# Altium schematic sheet propulsion_alim.SchDoc
size A3
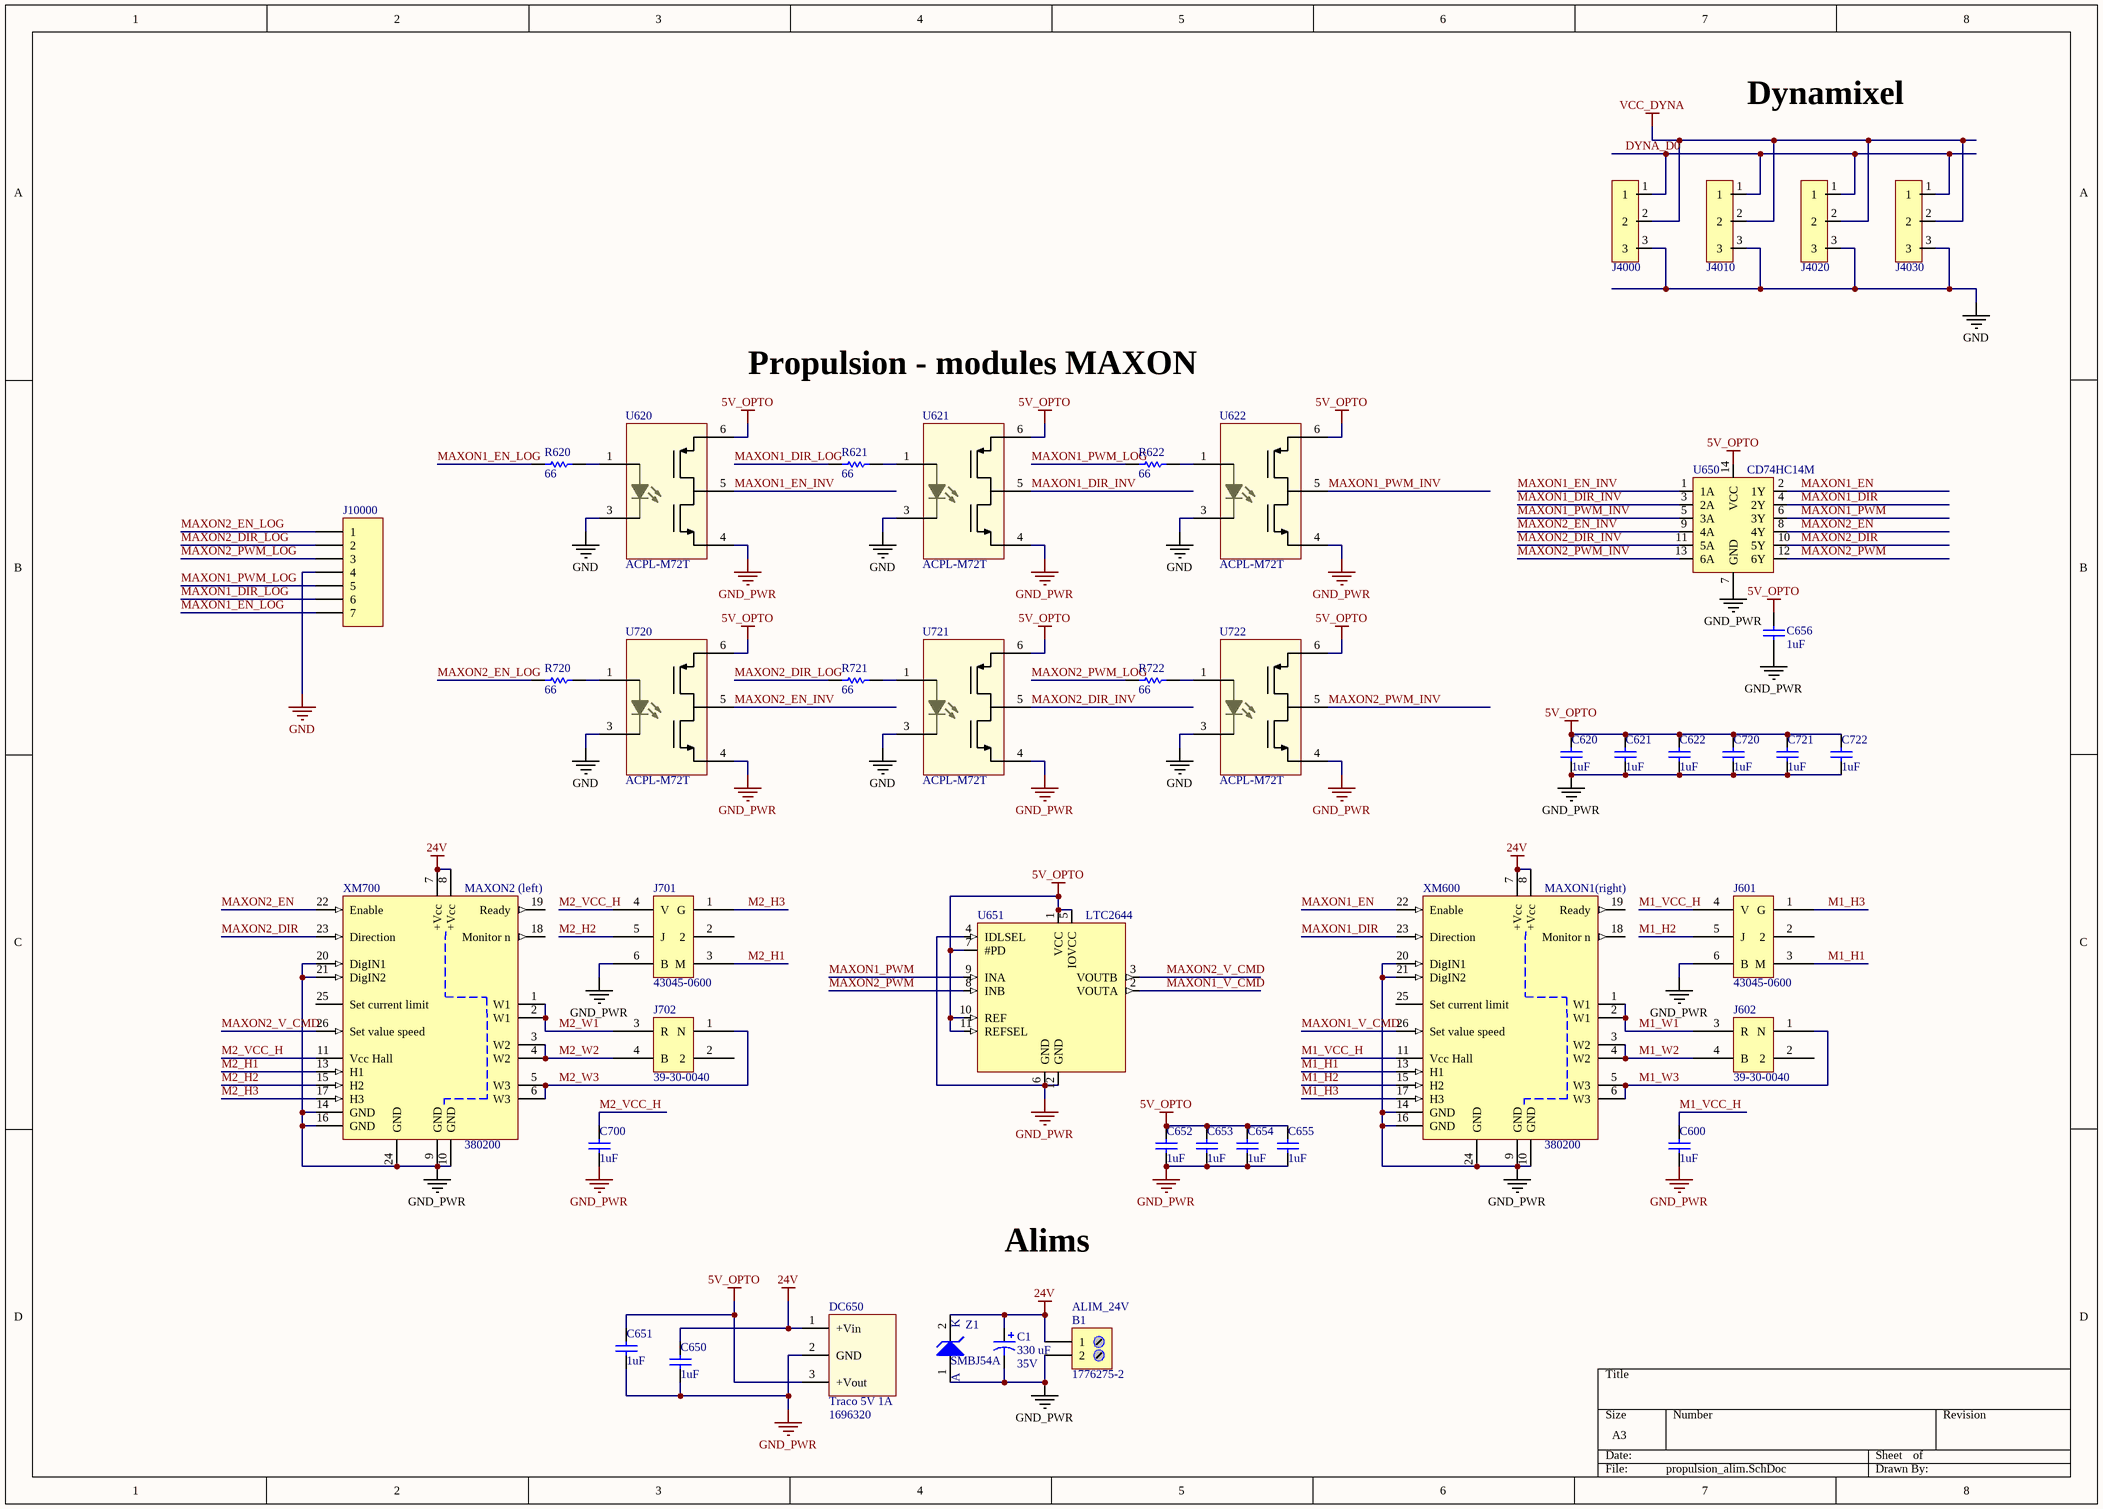
[diagram p0: propulsion_alim.SchDoc]

## Parts
B1  1776275-2  [BORNIER_2V_3.5MM]
C1  330 uF  RatedVoltage: 35V  [WCAP-ATG8_10x12.5x5x0.6]
C600  1uF  [WCAP-CSGP_0805, 2x1.25x1.25]
C620  1uF  [WCAP-CSGP_0805, 2x1.25x1.25]
C621  1uF  [WCAP-CSGP_0805, 2x1.25x1.25]
C622  1uF  [WCAP-CSGP_0805, 2x1.25x1.25]
C650  1uF  [WCAP-CSGP_0805, 2x1.25x1.25]
C651  1uF  [WCAP-CSGP_0805, 2x1.25x1.25]
C652  1uF  [WCAP-CSGP_0805, 2x1.25x1.25]
C653  1uF  [WCAP-CSGP_0805, 2x1.25x1.25]
C654  1uF  [WCAP-CSGP_0805, 2x1.25x1.25]
C655  1uF  [WCAP-CSGP_0805, 2x1.25x1.25]
C656  1uF  [WCAP-CSGP_0805, 2x1.25x1.25]
C700  1uF  [WCAP-CSGP_0805, 2x1.25x1.25]
C720  1uF  [WCAP-CSGP_0805, 2x1.25x1.25]
C721  1uF  [WCAP-CSGP_0805, 2x1.25x1.25]
C722  1uF  [WCAP-CSGP_0805, 2x1.25x1.25]
DC650  Traco 5V 1A  Supplier Part Number 1: 1696320  [TSR1]
J601  43045-0600  [43045-0600]
J602  39-30-0040  [39-30-0040]
J701  43045-0600  [43045-0600]
J702  39-30-0040  [39-30-0040]
J4000  22-03-5035  [20-03-5035]  (value not drawn)
J4010  22-03-5035  [20-03-5035]  (value not drawn)
J4020  22-03-5035  [20-03-5035]  (value not drawn)
J4030  22-03-5035  [20-03-5035]  (value not drawn)
J10000  (no value)  [HDR1X7]
R620  value 66  [RESC1608X06N]  (hidden comment: RC0603FR-0710KL)
R621  value 66  [RESC1608X06N]  (hidden comment: RC0603FR-0710KL)
R622  value 66  [RESC1608X06N]  (hidden comment: RC0603FR-0710KL)
R720  value 66  [RESC1608X06N]  (hidden comment: RC0603FR-0710KL)
R721  value 66  [RESC1608X06N]  (hidden comment: RC0603FR-0710KL)
R722  value 66  [RESC1608X06N]  (hidden comment: RC0603FR-0710KL)
U620  ACPL-M72T  [ACPL-M72T]
U621  ACPL-M72T  [ACPL-M72T]
U622  ACPL-M72T  [ACPL-M72T]
U650  CD74HC14M  [SOIC127P600X175-14N]
U651  LTC2644  [MSOP-12_LTC2644]
U720  ACPL-M72T  [ACPL-M72T]
U721  ACPL-M72T  [ACPL-M72T]
U722  ACPL-M72T  [ACPL-M72T]
XM600  380200  [380200_goldo]
XM700  380200  [380200_goldo]
Z1  SMBJ54A  [SMA Diode (DO-214AA)]

## Nets
5V_OPTO: C620.2 C621.2 C622.2 C651.2 C652.2 C653.2 C654.2 C655.2 C656.2 C720.2 C721.2 C722.2 DC650.3(+Vout) U620.6(VDD) U621.6(VDD) U622.6(VDD) U650.14(VCC) U651.1(VCC) U651.5(IOVCC) U651.7(#PD) U651.10(REF) U651.11(REFSEL) U720.6(VDD) U721.6(VDD) U722.6(VDD)
24V: B1.1 C1.1 C650.2 DC650.1(+Vin) XM600.7(+Vcc) XM600.8(+Vcc) XM700.7(+Vcc) XM700.8(+Vcc) Z1.2
GND: J4000.3 J4010.3 J4020.3 J4030.3 J10000.4 U620.3(Cathode) U621.3(Cathode) U622.3(Cathode) U720.3(Cathode) U721.3(Cathode) U722.3(Cathode)
GND_PWR: B1.2 C1.2 C600.1 C620.1 C621.1 C622.1 C650.1 C651.1 C652.1 C653.1 C654.1 C655.1 C656.1 C700.1 C720.1 C721.1 C722.1 DC650.2(GND) J601.6(B) J701.6(B) U620.4(GND) U621.4(GND) U622.4(GND) U650.7(GND) U651.4(IDLSEL) U651.6(GND) U651.12(GND) U720.4(GND) U721.4(GND) U722.4(GND) XM600.9(GND) XM600.10(GND) XM600.14(GND) XM600.16(GND) XM600.20(DigIN1) XM600.21(DigIN2) XM600.24(GND) XM700.9(GND) XM700.10(GND) XM700.14(GND) XM700.16(GND) XM700.20(DigIN1) XM700.21(DigIN2) XM700.24(GND) Z1.1
VCC_DYNA: J4000.2 J4010.2 J4020.2 J4030.2
DYNA_D0: J4000.1 J4010.1 J4020.1 J4030.1
M1_H1: J601.3(M) XM600.13(H1)
M1_H2: J601.5(J) XM600.15(H2)
M1_H3: J601.1(G) XM600.17(H3)
M1_VCC_H: C600.2 J601.4(V) XM600.11(Vcc_Hall)
M1_W1: J602.3(R) XM600.1(W1) XM600.2(W1)
M1_W2: J602.4(B) XM600.3(W2) XM600.4(W2)
M1_W3: J602.1(N) XM600.5(W3) XM600.6(W3)
M2_H1: J701.3(M) XM700.13(H1)
M2_H2: J701.5(J) XM700.15(H2)
M2_H3: J701.1(G) XM700.17(H3)
M2_VCC_H: C700.2 J701.4(V) XM700.11(Vcc_Hall)
M2_W1: J702.3(R) XM700.1(W1) XM700.2(W1)
M2_W2: J702.4(B) XM700.3(W2) XM700.4(W2)
M2_W3: J702.1(N) XM700.5(W3) XM700.6(W3)
MAXON1_DIR: U650.4(2Y) XM600.23(Direction)
MAXON1_DIR_INV: U621.5(Vo) U650.3(2A)
MAXON1_DIR_LOG: J10000.6 R621.1
MAXON1_EN: U650.2(1Y) XM600.22(Enable)
MAXON1_EN_INV: U620.5(Vo) U650.1(1A)
MAXON1_EN_LOG: J10000.7 R620.1
MAXON1_PWM: U650.6(3Y) U651.9(INA)
MAXON1_PWM_INV: U622.5(Vo) U650.5(3A)
MAXON1_PWM_LOG: J10000.5 R622.1
MAXON1_V_CMD: U651.2(VOUTA) XM600.26(Set_value_speed)
MAXON2_DIR: U650.10(5Y) XM700.23(Direction)
MAXON2_DIR_INV: U650.11(5A) U721.5(Vo)
MAXON2_DIR_LOG: J10000.2 R721.1
MAXON2_EN: U650.8(4Y) XM700.22(Enable)
MAXON2_EN_INV: U650.9(4A) U720.5(Vo)
MAXON2_EN_LOG: J10000.1 R720.1
MAXON2_PWM: U650.12(6Y) U651.8(INB)
MAXON2_PWM_INV: U650.13(6A) U722.5(Vo)
MAXON2_PWM_LOG: J10000.3 R722.1
MAXON2_V_CMD: U651.3(VOUTB) XM700.26(Set_value_speed)
NetR620_2: R620.2 U620.1(Anode)
NetR621_2: R621.2 U621.1(Anode)
NetR622_2: R622.2 U622.1(Anode)
NetR720_2: R720.2 U720.1(Anode)
NetR721_2: R721.2 U721.1(Anode)
NetR722_2: R722.2 U722.1(Anode)

Not connected (* = marked no-connect by the designer): J601 2; J602 2; J701 2; J702 2; XM600 12(nc) 18(Monitor_n) 19(Ready) 25(Set_current_limit); XM700 12(nc) 18(Monitor_n) 19(Ready) 25(Set_current_limit)

## Notes on the sheet
- Dynamixel
- Propulsion - modules MAXON
- (near XM700) MAXON2 (left)
- (near XM600) MAXON1(right)
- Alims
- (near B1) ALIM_24V
- (in symbol SMBJ54A) K; A

## Library data of the parts
B1 = 1776275-2: TERM BLOCK 2POS SIDE ENT 3.5MM; Manufacturer: TE Connectivity AMP Connectors; Supplier 1: Farnell; Supplier Part Number 1: 1098611; Manufacturer Part Number: 1776275-2; ComponentLink1URL: http://www.te.com/commerce/DocumentDelivery/DDEController?Action=srchrtrv&DocNm=1776275&DocType=Customer+Drawing&DocLang=English; ComponentLink1Description: http://www.te.com/commerce/DocumentDelivery/DDEController?Action=srchrtrv&DocNm=1776275&DocType=Customer+Drawing&DocLang=English
C1 = WCAP-ATG8, 860010575012: CAP Alu 330 UF 20% 35 V; Manufacturer: Wurth Elektronik; PublishedDate: July 2016; ComponentLink1Description: Manufacturer; ComponentLink1URL: http://www.we-online.de; ComponentLink2Description: Datasheet; ComponentLink2URL: http://katalog.we-online.de/pbs/datasheet/860010575012.pdf; Manufacturer Part Number: 860010575012; Value: 330 uF; Size: 10mmx12.5mm
C600 C620-C622 C650-C656 C700 C720-C722 = WCAP-CSGP, 885012207103: CAP CER 1uF 50V X7R 0805; Manufacturer: Wurth Elektronik; PublishedDate: Aug 2016; ComponentLink1Description: Manufacturer; ComponentLink1URL: http://www.we-online.de; ComponentLink2Description: Datasheet; ComponentLink2URL: http://katalog.we-online.com/pbs/datasheet/885012207103.pdf; Manufacturer Part Number: 885012207103; Value: 1uF; Size: 0805; CeramicType: X7R; RatedVoltage: 50V
DC650 = TSR1-24120: Traco 12.0V 12W 1A; Manufacturer: TRACOPOWER; Manufacturer Part Number: TSR1-2450; Pricing: 1=65.7, 5=63.73, 10=61.82, 25=59.97 (EUR); Supplier 1: Farnell
J601 J701 = 43045-0600: CONN HEADER 6POS 3MM RT ANG TIN; Manufacturer: MOLEX; Supplier 1: Farnell; Manufacturer Part Number: 43045-0600; ComponentLink1URL: http://www.farnell.com/datasheets/2216475.pdf; ComponentLink1Description: http://www.farnell.com/datasheets/2216475.pdf; Supplier Part Number 1: 1012252
J602 J702 = 39-30-0040: MOLEX  39-30-0040 4.2 mm, 4 Contact(s); Supplier 1: Farnell; Supplier Part Number 1: 1697133; Manufacturer: MOLEX; Manufacturer Part Number: 39-30-0040; ComponentLink1URL: http://www.farnell.com/datasheets/328793.pdf; ComponentLink1Description: http://www.farnell.com/datasheets/328793.pdf
J4000 J4010 J4020 J4030 = 20-03-5035: Manufacturer 1: MOLEX; Supplier 1: Farnell; Supplier Part Number 1: 9979620; Manufacturer Part Number: 22-03-5035; Pricing: 10=0.153, 100=0.144, 250=0.118, 500=0.091, 1000=0.059, 2500=0.057, 2500=0.0441, 30000=0.0397 (EUR); ComponentLink1URL: http://www.farnell.com/cad/495071.pdf; ComponentLink1Description: http://www.farnell.com/cad/495071.pdf; ComponentLink2URL: http://www.farnell.com/datasheets/1801024.pdf; ComponentLink2Description: http://www.farnell.com/datasheets/1801024.pdf; ComponentLink3Description: http://fr.farnell.com/jsp/level5/module.jsp?moduleId=fr/418942.xml; ComponentLink3URL: http://fr.farnell.com/jsp/level5/module.jsp?moduleId=fr/418942.xml; ComponentClass: 4_NUCLEO_DYNA
J10000 = HDR1X7: CONN HEADER 7POS 100MILS
R620-R622 R720-R722 = RC0603FR-0710KL: RES SMD 10K OHM 1% 1/10W 0603; Manufacturer: Yageo; Power: 100mW; Vmax: 50V; Manufacturer Part Number: RC0603FR-0710KL; Type: Thick Film; ComponentLink1Description: Manufacturer; ComponentLink1URL: http://www.yageo.com/NewPortal/_en/index.jsp; ComponentLink2Description: Datasheet; ComponentLink2URL: http://www.farnell.com/datasheets/2167052.pdf; Supplier 1: Farnell; Supplier Part Number 1: 9238603; Precision: ±1%
U620-U622 U720-U722 = ACPL-M72T: Optocoupleur; Manufacturer: AVAGO TECHNOLOGIES; Supplier 1: Mouser; Manufacturer Part Number: ACPL-M72T
U650 = CD74HC14M: IC HEX INV SCHMITT TRIG 14-SOIC; Manufacturer: Texas Instruments; Supplier 1: Farnell; Supplier Part Number 1: 1103160; Manufacturer Part Number: CD74HC14M; ComponentLink1URL: http://www.ti.com/lit/ds/symlink/cd74hc14.pdf; ComponentLink1Description: http://www.ti.com/lit/ds/symlink/cd74hc14.pdf
XM600 XM700 = 380200: DEC Module 50/5, amplificateur EC 1 Q 50 V / 5 A, régulation de vitesse, module OEM; Manufacturer: Maxon Motor; Manufacturer Part Number: 380200; ComponentLink1URL: http://www.maxonmotor.fr/medias/sys_master/root/8816547528734/380200-Notice-dUtilisation-Fr.pdf; ComponentLink1Description: http://www.maxonmotor.fr/medias/sys_master/root/8816547528734/380200-Notice-dUtilisation-Fr.pdf
Z1 = SMBJ54A: DIODE TVS (Transil unidirectionelle); Manufacturer: ON Semiconductor; Value: 54V; Supplier 1: Farnell; Manufacturer Part Number: SMBJ54A; ComponentLink1URL: http://www.fairchildsemi.com/datasheets/SM/SMBJ54A.pdf; ComponentLink1Description: http://www.fairchildsemi.com/datasheets/SM/SMBJ54A.pdf; Supplier part number 1: 1700734
U651 = LTC2644: Manufacturer Part Number: LTC2644